# Altium schematic sheet Configuration&Clocking&SRAM.SchDoc: {Наименование}
size 420 x 297 mm; DocumentNumber: ВКА.821011.000.ПЗ; PageSetup: Record=PageOptions|CenterHorizontal=False|CenterVertical=False|PrintScale=0.70|XCorrection=0.00|YCorrection=0.00|PrintKind=1|BorderSize=5000000|LeftOffset=0|BottomOffset=0|Orientation=1|PaperLength=2970|PaperWidth=4200|Scale=100|PaperSource=7|PrintQuality=600|MediaType=1|DitherType=10|PrintScaleMode=1|PaperKind=A3 (повернуто)|PaperIndex=76; Rule: PcbType=ProtelPcb
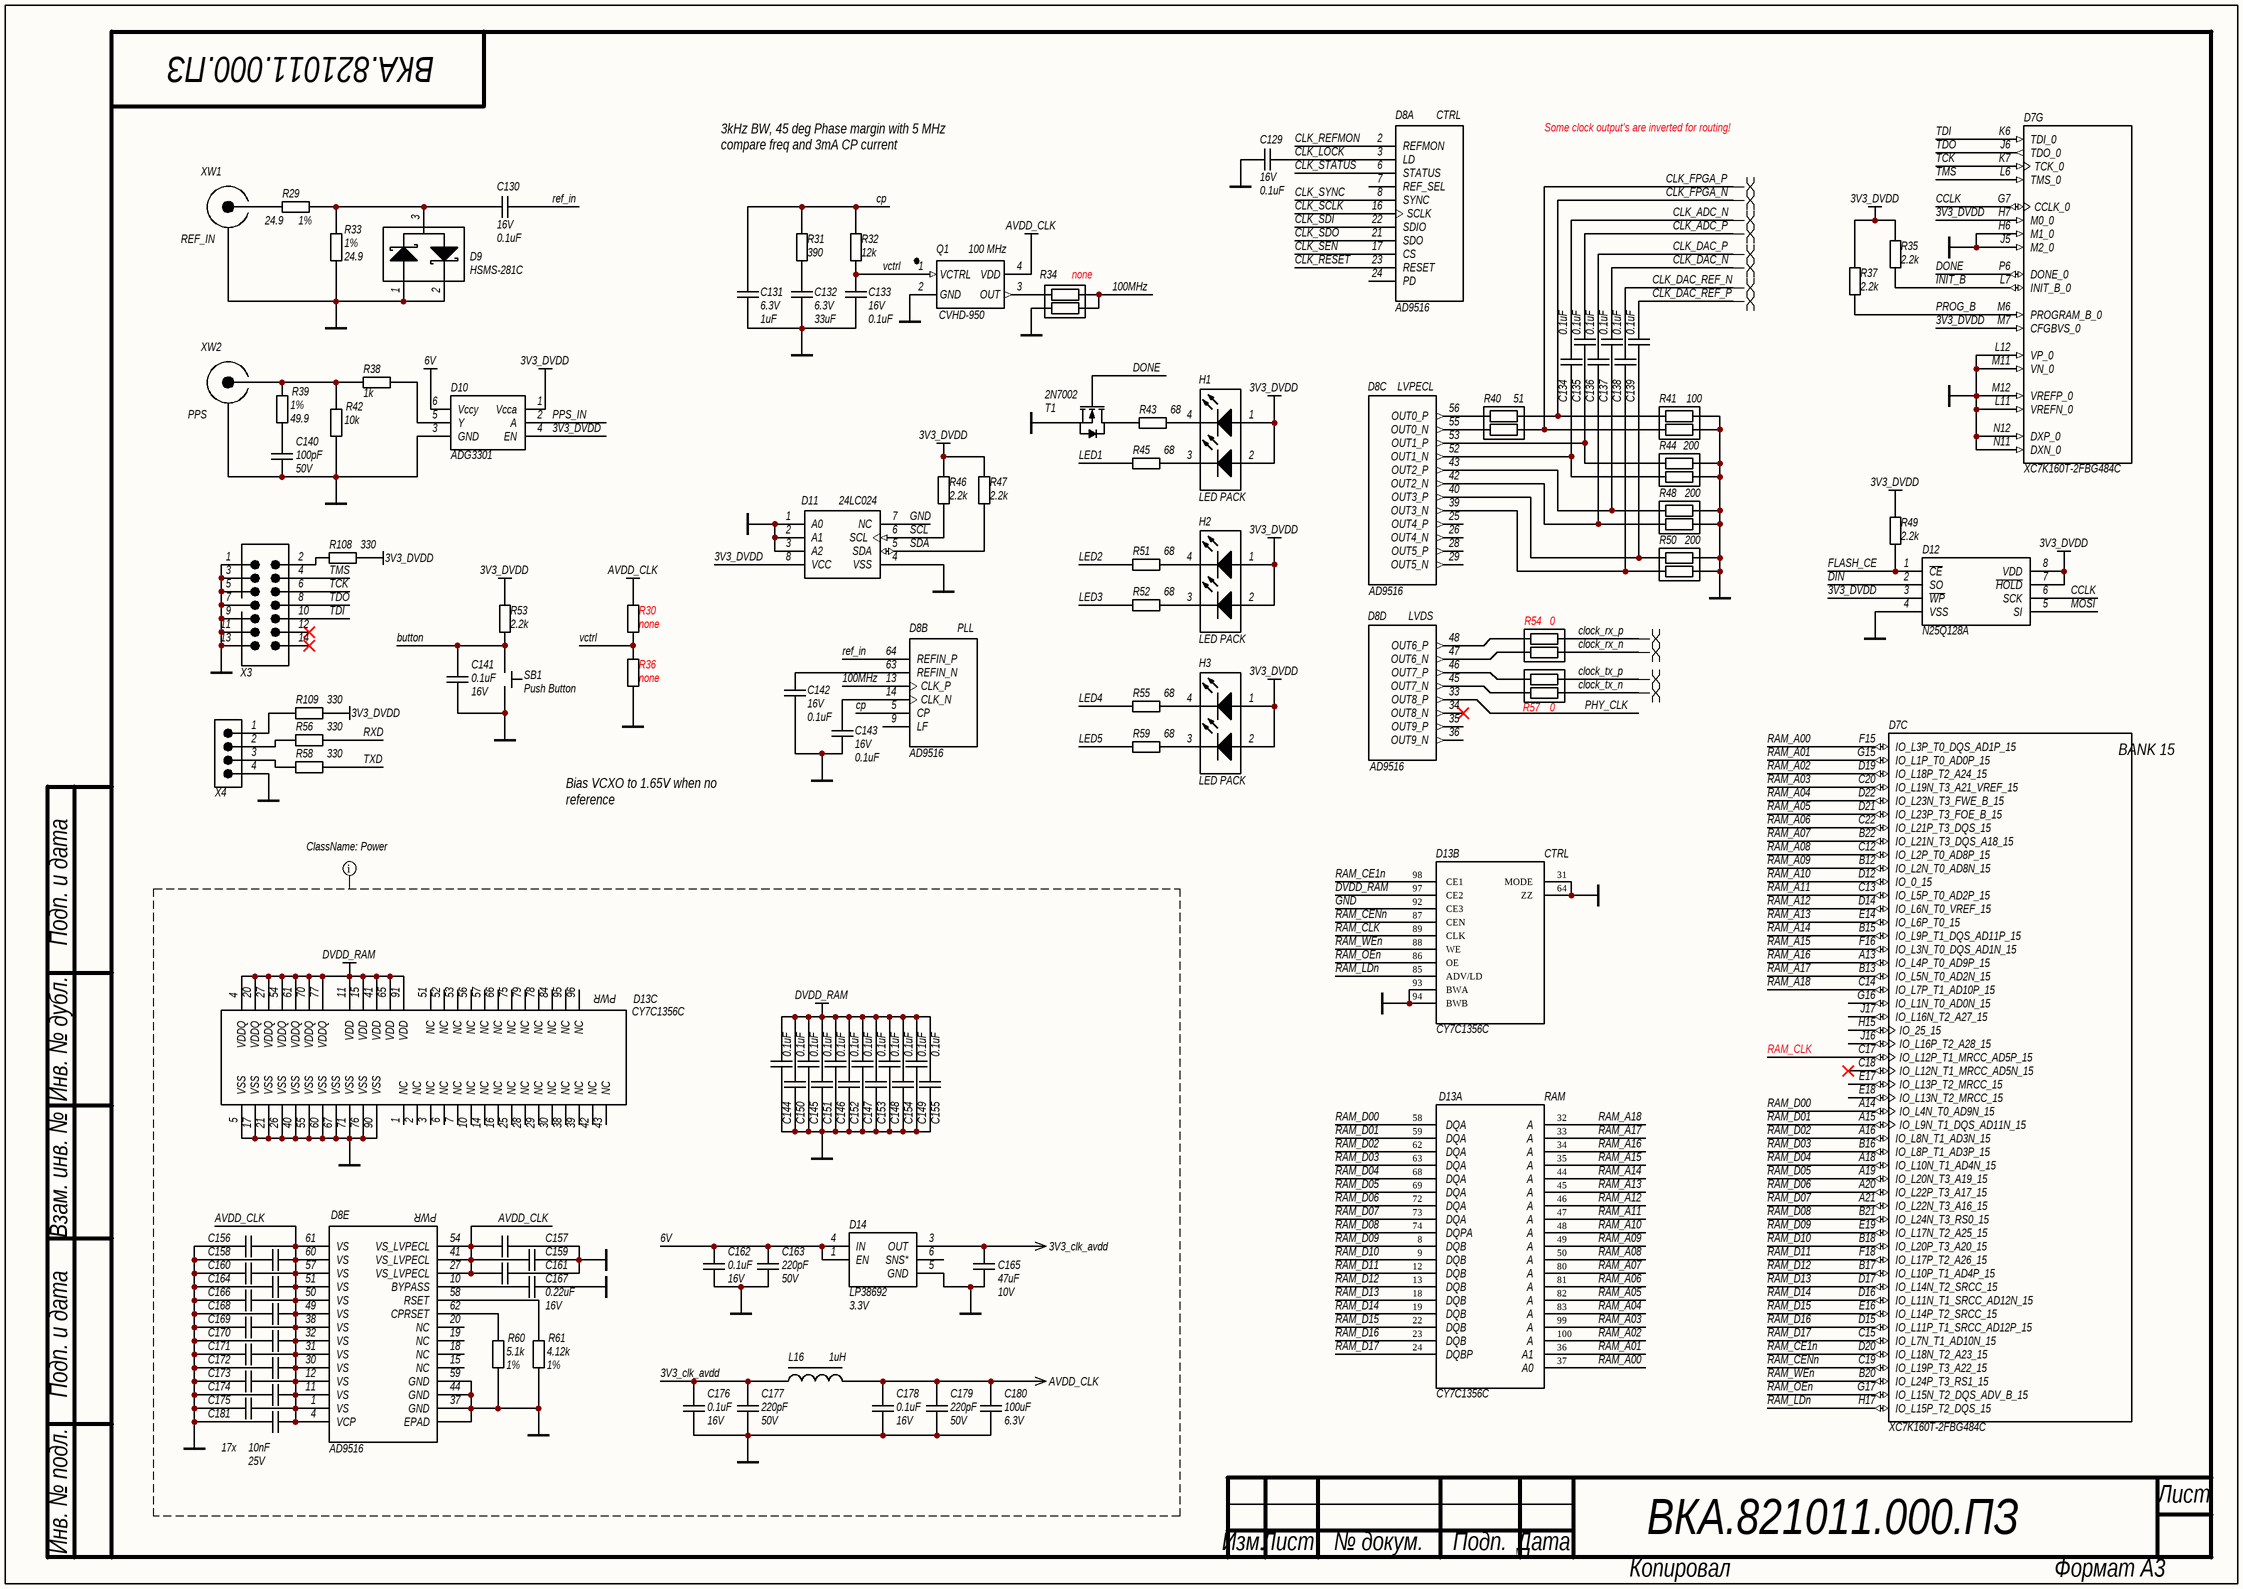
[diagram p0: Configuration&Clocking&SRAM.SchDoc]

## Parts
C129  value 0.1uF  Voltage: 16V  [C0402]  (hidden comment: CAP)
C130  value 0.1uF  Voltage: 16V  [C0402]  (hidden comment: CAP)
C131  value 1uF  Voltage: 6.3V  [C0402]  (hidden comment: CAP)
C132  value 33uF  Voltage: 6.3V  [C1210]  (hidden comment: CAP uF)
C133  value 0.1uF  Voltage: 16V  [C0402]  (hidden comment: CAP)
C134  value 0.1uF  [C0402]  (hidden comment: CAP)
C135  value 0.1uF  [C0402]  (hidden comment: CAP)
C136  value 0.1uF  [C0402]  (hidden comment: CAP)
C137  value 0.1uF  [C0402]  (hidden comment: CAP)
C138  value 0.1uF  [C0402]  (hidden comment: CAP)
C139  value 0.1uF  [C0402]  (hidden comment: CAP)
C140  value 100pF  Voltage: 50V  [C0603]  (hidden comment: CAP)
C141  value 0.1uF  Voltage: 16V  [C0402]  (hidden comment: CAP)
C142  value 0.1uF  Voltage: 16V  [C0402]  (hidden comment: CAP)
C143  value 0.1uF  Voltage: 16V  [C0402]  (hidden comment: CAP)
C144  value 0.1uF  [C0402]  (hidden comment: CAP)
C145  value 0.1uF  [C0402]  (hidden comment: CAP)
C146  value 0.1uF  [C0402]  (hidden comment: CAP)
C147  value 0.1uF  [C0402]  (hidden comment: CAP)
C148  value 0.1uF  [C0402]  (hidden comment: CAP)
C149  value 0.1uF  [C0402]  (hidden comment: CAP)
C150  value 0.1uF  [C0402]  (hidden comment: CAP)
C151  value 0.1uF  [C0402]  (hidden comment: CAP)
C152  value 0.1uF  [C0402]  (hidden comment: CAP)
C153  value 0.1uF  [C0402]  (hidden comment: CAP)
C154  value 0.1uF  [C0402]  (hidden comment: CAP)
C155  value 0.1uF  [C0402]  (hidden comment: CAP)
C156  CAP  [C0402]  (value not drawn)
C157  CAP  [C0402]  (value not drawn)
C158  CAP  [C0402]  (value not drawn)
C159  CAP  [C0402]  (value not drawn)
C160  CAP  [C0402]  (value not drawn)
C161  CAP  [C0402]  (value not drawn)
C162  value 0.1uF  Voltage: 16V  [C0603]  (hidden comment: CAP)
C163  value 220pF  Voltage: 50V  [C0603]  (hidden comment: CAP)
C164  CAP  [C0402]  (value not drawn)
C165  value 47uF  Voltage: 10V  [C1210]  (hidden comment: CAP uF)
C166  CAP  [C0402]  (value not drawn)
C167  value 0.22uF  Voltage: 16V  [C0402]  (hidden comment: CAP)
C168  CAP  [C0402]  (value not drawn)
C169  CAP  [C0402]  (value not drawn)
C170  CAP  [C0402]  (value not drawn)
C171  CAP  [C0402]  (value not drawn)
C172  CAP  [C0402]  (value not drawn)
C173  CAP  [C0402]  (value not drawn)
C174  CAP  [C0402]  (value not drawn)
C175  CAP  [C0402]  (value not drawn)
C176  value 0.1uF  Voltage: 16V  [C0603]  (hidden comment: CAP)
C177  value 220pF  Voltage: 50V  [C0603]  (hidden comment: CAP)
C178  value 0.1uF  Voltage: 16V  [C0603]  (hidden comment: CAP)
C179  value 220pF  Voltage: 50V  [C0603]  (hidden comment: CAP)
C180  value 100uF  Voltage: 6.3V  [C1210]  (hidden comment: CAP uF)
C181  value 10nF  Voltage: 25V  [C0402]  (hidden comment: CAP)
D7  XC7K160T-2FBG484C  [FBG484]  (parts C,G of 12)
D8  AD9516  [LFCSP-64]  (parts A,B,C,D,E of 5)
D9  HSMS-281C  [SOT-323]
D10  ADG3301  [SOT-23-6]
D11  24LC024  [SOIC_SN8]
D12  N25Q128A  [SOIC8-W]
D13  CY7C1356C  [TQFP-100]  (parts A,B,C of 3)
D14  LP38692  Voltage: 3.3V  [SOT-223-5]
H1  LED PACK  [LED_PACK]
H2  LED PACK  [LED_PACK]
H3  LED PACK  [LED_PACK]
L16  value 1uH  [L1210_Murata]  (hidden comment: Inductor LF)
Q1  CVHD-950  Frequency: 100 MHz  [CVHD-950]
R29  value 24.9  Tolerance: 1%  [R0402]  (hidden comment: RES)
R30  value none  [R0402]  (hidden comment: RES)
R31  value 390  [R0402]  (hidden comment: RES)
R32  value 12k  [R0402]  (hidden comment: RES)
R33  value 24.9  Tolerance: 1%  [R0402]  (hidden comment: RES)
R34  value none  [EX24V]  (hidden comment: RES 2x0402)
R35  value 2.2k  [R0402]  (hidden comment: RES)
R36  value none  [R0402]  (hidden comment: RES)
R37  value 2.2k  [R0402]  (hidden comment: RES)
R38  value 1k  [R0402]  (hidden comment: RES)
R39  value 49.9  Tolerance: 1%  [R0402]  (hidden comment: RES)
R40  value 51  [EX24V]  (hidden comment: RES 2x0402)
R41  value 100  [EX24V]  (hidden comment: RES 2x0402)
R42  value 10k  [R0402]  (hidden comment: RES)
R43  value 68  [R0402]  (hidden comment: RES)
R44  value 200  [EX24V]  (hidden comment: RES 2x0402)
R45  value 68  [R0402]  (hidden comment: RES)
R46  value 2.2k  [R0402]  (hidden comment: RES)
R47  value 2.2k  [R0402]  (hidden comment: RES)
R48  value 200  [EX24V]  (hidden comment: RES 2x0402)
R49  value 2.2k  [R0402]  (hidden comment: RES)
R50  value 200  [EX24V]  (hidden comment: RES 2x0402)
R51  value 68  [R0402]  (hidden comment: RES)
R52  value 68  [R0402]  (hidden comment: RES)
R53  value 2.2k  [R0402]  (hidden comment: RES)
R54  value 0  [EX24V]  (hidden comment: RES 2x0402)
R55  value 68  [R0402]  (hidden comment: RES)
R56  value 330  [R0402]  (hidden comment: RES)
R57  value 0  [EX24V]  (hidden comment: RES 2x0402)
R58  value 330  [R0402]  (hidden comment: RES)
R59  value 68  [R0402]  (hidden comment: RES)
R60  value 5.1k  Tolerance: 1%  [R0402]  (hidden comment: RES)
R61  value 4.12k  Tolerance: 1%  [R0402]  (hidden comment: RES)
R108  value 330  [R0402]  (hidden comment: RES)
R109  value 330  [R0402]  (hidden comment: RES)
SB1  Push Button  [B3FS-1000]
T1  2N7002  [SOT-23]
X3  HDR Debug_14-pin  [JTAG Header 14-pin]  (value not drawn)
X4  HDR 4-way  [Right Angle Male Header]  (value not drawn)
XW1  REF_IN  [SMA Angle Female]
XW2  PPS  [SMA Angle Female]

## Nets
3V3_clk_avdd: C165.2 C176.2 C177.2 D14.3(OUT) L16.1
3V3_DVDD: D7.H7(M0_0) D7.M7(CFGBVS_0) D10.1(Vcca) D10.4(EN) D11.8(VCC) D12.3(~{WP}) D12.7(~{HOLD}) D12.8(VDD) H1.1(A) H1.2(A) H2.1(A) H2.2(A) H3.1(A) H3.2(A) R35.2 R37.2 R46.2 R47.2 R49.2 R53.2 R108.1 R109.1
6V: C162.2 C163.2 D10.6(Vccy) D14.1(EN) D14.4(IN)
AVDD_CLK: C156.1 C157.2 C158.1 C159.2 C160.1 C161.2 C164.1 C166.1 C168.1 C169.1 C170.1 C171.1 C172.1 C173.1 C174.1 C175.1 C178.2 C179.2 C180.2 C181.1 D8.1(VS) D8.4(VCP) D8.11(VS) D8.12(VS) D8.27(VS_LVPECL) D8.30(VS) D8.31(VS) D8.32(VS) D8.38(VS) D8.41(VS_LVPECL) D8.49(VS) D8.50(VS) D8.51(VS) D8.54(VS_LVPECL) D8.57(VS) D8.60(VS) D8.61(VS) L16.2 Q1.4(VDD) R30.2
DVDD_RAM: C144.2 C145.2 C146.2 C147.2 C148.2 C149.2 C150.2 C151.2 C152.2 C153.2 C154.2 C155.2 D13.4(VDDQ) D13.11(VDD) D13.15(VDD) D13.20(VDDQ) D13.27(VDDQ) D13.41(VDD) D13.54(VDDQ) D13.61(VDDQ) D13.65(VDD) D13.70(VDDQ) D13.77(VDDQ) D13.91(VDD) D13.97(CE2)
GND: C129.2 C131.2 C132.2 C133.2 C140.1 C141.1 C142.2 C143.2 C144.1 C145.1 C146.1 C147.1 C148.1 C149.1 C150.1 C151.1 C152.1 C153.1 C154.1 C155.1 C156.2 C157.1 C158.2 C159.1 C160.2 C161.1 C162.1 C163.1 C164.2 C165.1 C166.2 C167.1 C168.2 C169.2 C170.2 C171.2 C172.2 C173.2 C174.2 C175.2 C176.1 C177.1 C178.1 C179.1 C180.1 C181.2 D7.H6(M1_0) D7.J5(M2_0) D7.L11(VREFN_0) D7.L12(VP_0) D7.M11(VN_0) D7.M12(VREFP_0) D7.N11(DXN_0) D7.N12(DXP_0) D8.0(EPAD) D8.37(GND) D8.44(GND) D8.59(GND) D9.1(A) D9.2(K) D10.3(GND) D11.1(A0) D11.2(A1) D11.3(A2) D11.4(VSS) D11.7(NC) D12.4(VSS) D13.5(VSS) D13.17(VSS) D13.21(VSS) D13.26(VSS) D13.31(MODE) D13.40(VSS) D13.55(VSS) D13.60(VSS) D13.64(ZZ) D13.67(VSS) D13.71(VSS) D13.76(VSS) D13.90(VSS) D13.92(CE3) D13.93(BWA) D13.94(BWB) D14.5(GND) Q1.2(GND) R33.1 R34.2 R36.1 R41.3 R41.4 R42.1 R44.3 R44.4 R48.3 R48.4 R50.3 R50.4 R60.1 R61.1 SB1.2 T1.2(S) X3.1(GND) X3.3(GND) X3.5(GND) X3.7(GND) X3.9(GND) X3.11(GND) X3.13(GND) X4.4(TMS) XW1.0(GND) XW2.0(GND)
100MHz: D8.13(CLK_P) R34.3 R34.4
button: C141.2 R53.1 SB1.1
CCLK: D7.G7(CCLK_0) D12.6(SCK)
CLK_ADC_N: C134.1
CLK_ADC_P: C135.1
CLK_DAC_N: C137.1
CLK_DAC_P: C136.1
CLK_DAC_REF_N: C138.1
CLK_DAC_REF_P: C139.1
CLK_FPGA_N: R40.4 R41.1
CLK_FPGA_P: R40.3 R41.2
CLK_LOCK: C129.1 D8.3(LD)
CLK_REFMON: D8.2(REFMON)
CLK_RESET: D8.23(RESET)
CLK_SCLK: D8.16(SCLK)
CLK_SDI: D8.22(SDIO)
CLK_SDO: D8.21(SDO)
CLK_SEN: D8.17(CS)
CLK_STATUS: D8.6(STATUS)
CLK_SYNC: D8.8(SYNC)
clock_rx_n: R54.3
clock_rx_p: R54.4
clock_tx_n: R57.3
clock_tx_p: R57.4
cp: C131.1 D8.5(CP) R31.1 R32.2
DIN: D12.2(SO)
DONE: D7.P6(DONE_0) T1.1(G)
FLASH_CE: D12.1(~{CE}) R49.1
INIT_B: D7.L7(INIT_B_0) R35.1
LED1: R45.2
LED2: R51.2
LED3: R52.2
LED4: R55.2
LED5: R59.2
MOSI: D12.5(SI)
PHY_CLK: D8.33(OUT8_P)
PPS_IN: D10.2(A)
PROG_B: D7.M6(PROGRAM_B_0) R37.1
RAM_A00: D7.F15(IO_L3P_T0_DQS_AD1P_15) D13.37(A0)
RAM_A01: D7.G15(IO_L1P_T0_AD0P_15) D13.36(A1)
RAM_A02: D7.D19(IO_L18P_T2_A24_15) D13.100(A)
RAM_A03: D7.C20(IO_L19N_T3_A21_VREF_15) D13.99(A)
RAM_A04: D7.D22(IO_L23N_T3_FWE_B_15) D13.83(A)
RAM_A05: D7.D21(IO_L23P_T3_FOE_B_15) D13.82(A)
RAM_A06: D7.C22(IO_L21P_T3_DQS_15) D13.81(A)
RAM_A07: D7.B22(IO_L21N_T3_DQS_A18_15) D13.80(A)
RAM_A08: D7.C12(IO_L2P_T0_AD8P_15) D13.50(A)
RAM_A09: D7.B12(IO_L2N_T0_AD8N_15) D13.49(A)
RAM_A10: D7.D12(IO_0_15) D13.48(A)
RAM_A11: D7.C13(IO_L5P_T0_AD2P_15) D13.47(A)
RAM_A12: D7.D14(IO_L6N_T0_VREF_15) D13.46(A)
RAM_A13: D7.E14(IO_L6P_T0_15) D13.45(A)
RAM_A14: D7.B15(IO_L9P_T1_DQS_AD11P_15) D13.44(A)
RAM_A15: D7.F16(IO_L3N_T0_DQS_AD1N_15) D13.35(A)
RAM_A16: D7.A13(IO_L4P_T0_AD9P_15) D13.34(A)
RAM_A17: D7.B13(IO_L5N_T0_AD2N_15) D13.33(A)
RAM_A18: D7.C14(IO_L7P_T1_AD10P_15) D13.32(A)
RAM_CE1n: D7.D20(IO_L18N_T2_A23_15) D13.98(CE1)
RAM_CENn: D7.C19(IO_L19P_T3_A22_15) D13.87(CEN)
RAM_CLK: D7.C17(IO_L12P_T1_MRCC_AD5P_15) D13.89(CLK)
RAM_D00: D7.A14(IO_L4N_T0_AD9N_15) D13.58(DQA)
RAM_D01: D7.A15(IO_L9N_T1_DQS_AD11N_15) D13.59(DQA)
RAM_D02: D7.A16(IO_L8N_T1_AD3N_15) D13.62(DQA)
RAM_D03: D7.B16(IO_L8P_T1_AD3P_15) D13.63(DQA)
RAM_D04: D7.A18(IO_L10N_T1_AD4N_15) D13.68(DQA)
RAM_D05: D7.A19(IO_L20N_T3_A19_15) D13.69(DQA)
RAM_D06: D7.A20(IO_L22P_T3_A17_15) D13.72(DQA)
RAM_D07: D7.A21(IO_L22N_T3_A16_15) D13.73(DQA)
RAM_D08: D7.B21(IO_L24N_T3_RS0_15) D13.74(DQPA)
RAM_D09: D7.E19(IO_L17N_T2_A25_15) D13.8(DQB)
RAM_D10: D7.B18(IO_L20P_T3_A20_15) D13.9(DQB)
RAM_D11: D7.F18(IO_L17P_T2_A26_15) D13.12(DQB)
RAM_D12: D7.B17(IO_L10P_T1_AD4P_15) D13.13(DQB)
RAM_D13: D7.D17(IO_L14N_T2_SRCC_15) D13.18(DQB)
RAM_D14: D7.D16(IO_L11N_T1_SRCC_AD12N_15) D13.19(DQB)
RAM_D15: D7.E16(IO_L14P_T2_SRCC_15) D13.22(DQB)
RAM_D16: D7.D15(IO_L11P_T1_SRCC_AD12P_15) D13.23(DQB)
RAM_D17: D7.C15(IO_L7N_T1_AD10N_15) D13.24(DQBP)
RAM_LDn: D7.H17(IO_L15P_T2_DQS_15) D13.85(ADV/LD)
RAM_OEn: D7.G17(IO_L15N_T2_DQS_ADV_B_15) D13.86(OE)
RAM_WEn: D7.B20(IO_L24P_T3_RS1_15) D13.88(WE)
ref_in: C130.1 D8.64(REFIN_P)
RXD: R56.1
SCL: D11.6(SCL) R46.1
SDA: D11.5(SDA) R47.1
TCK: D7.K7(TCK_0) X3.6(TCK)
TDI: D7.K6(TDI_0) X3.10(TDI)
TDO: D7.J6(TDO_0) X3.8(TDO)
TMS: D7.L6(TMS_0) X3.4(TMS)
TXD: R58.1
vctrl: C133.1 Q1.1(VCTRL) R30.1 R32.1 R36.2
NetC130_2: C130.2 D9.3(K) R29.2 R33.2
NetC132_1: C132.1 R31.2
NetC134_2: C134.2 D8.52(OUT1_N) R44.1
NetC135_2: C135.2 D8.53(OUT1_P) R44.2
NetC136_2: C136.2 D8.42(OUT2_N) R48.1
NetC137_2: C137.2 D8.43(OUT2_P) R48.2
NetC138_2: C138.2 D8.39(OUT3_N) R50.1
NetC139_2: C139.2 D8.40(OUT3_P) R50.2
NetC140_2: C140.2 R39.1
NetC142_1: C142.1 D8.63(REFIN_N)
NetC143_1: C143.1 D8.14(CLK_N)
NetC167_2: C167.2 D8.10(BYPASS)
NetD8_45: D8.45(OUT7_N) R57.2
NetD8_46: D8.46(OUT7_P) R57.1
NetD8_47: D8.47(OUT6_N) R54.2
NetD8_48: D8.48(OUT6_P) R54.1
NetD8_55: D8.55(OUT0_N) R40.2
NetD8_56: D8.56(OUT0_P) R40.1
NetD8_58: D8.58(RSET) R61.2
NetD8_62: D8.62(CPRSET) R60.2
NetD10_5: D10.5(Y) R38.1
NetH1_3: H1.3(K) R45.1
NetH1_4: H1.4(K) R43.1
NetH2_3: H2.3(K) R52.1
NetH2_4: H2.4(K) R51.1
NetH3_3: H3.3(K) R59.1
NetH3_4: H3.4(K) R55.1
NetQ1_3: Q1.3(OUT) R34.1
NetR29_1: R29.1 XW1.1(RF)
NetR38_2: R38.2 R39.2 R42.2 XW2.1(RF)
NetR43_2: R43.2 T1.3(D)
NetR56_2: R56.2 X4.2(VREF)
NetR58_2: R58.2 X4.3(GND)
NetR108_2: R108.2 X3.2(VREF)
NetR109_2: R109.2 X4.1(GND)

Not connected (* = marked no-connect by the designer): D7 C18(IO_L12N_T1_MRCC_AD5N_15)* E17(IO_L13P_T2_MRCC_15) E18(IO_L13N_T2_MRCC_15) G16(IO_L1N_T0_AD0N_15) H15(IO_25_15) J16(IO_L16P_T2_A28_15) J17(IO_L16N_T2_A27_15); D8 7(REF_SEL) 9(LF) 15(NC) 18(NC) 19(NC) 20(NC) 24(PD) 25(OUT4_P) 26(OUT4_N) 28(OUT5_P) 29(OUT5_N) 34(OUT8_N)* 35(OUT9_P) 36(OUT9_N); D13 1(NC) 2(NC) 3(NC) 6(NC) 7(NC) 10(NC) 14(NC) 16(NC) 25(NC) 28(NC) 29(NC) 30(NC) 38(NC) 39(NC) 42(NC) 43(NC) 51(NC) 52(NC) 53(NC) 56(NC) 57(NC) 66(NC) 75(NC) 78(NC) 79(NC) 84(NC) 95(NC) 96(NC); D14 6(SNS*); X3 12(NC)* 14(NC)*

## Layout directives
net class Power: 3V3_clk_avdd, 6V, AVDD_CLK, DVDD_RAM, GND
differential pair: CLK_ADC_N, CLK_ADC_P, CLK_DAC_N, CLK_DAC_P, CLK_DAC_REF_N, CLK_DAC_REF_P, CLK_FPGA_N, CLK_FPGA_P, clock_rx_n, clock_rx_p, clock_tx_n, clock_tx_p

## Notes on the sheet
- 3kHz BW, 45 deg Phase margin with 5 MHz compare freq and 3mA CP current
- Some clock output's are inverted for routing!
- Bias VCXO to 1.65V when no reference
- 17x
- Подп. и дата
- Инв. № дубл.
- Взам. инв. №
- Инв. № подл.
- Лист
- Изм.
- № докум.
- Подп.
- Дата
- Копировал
- Формат А3
- (in symbol AD9516, part A) CTRL
- (in symbol AD9516, part B) PLL
- (in symbol AD9516, part C) LVPECL
- (in symbol AD9516, part D) LVDS
- (in symbol AD9516, part E) PWR
- (in symbol CY7C1356C, part A) RAM
- (in symbol CY7C1356C, part B) CTRL
- (in symbol CY7C1356C, part C) PWR
- (in symbol XC7K160T-2FBG484C, part C) BANK 15

## Library data of the parts
C129 C130 C133 C141-C143 = CAP: SMD Capacitor; Manufacturer: Murata; Material: X7R; Tolerance: 10%; Type: Ceramic Capacitor; P/N: GRM155R71C104KA88J
C131 = CAP: SMD Capacitor; Manufacturer: Murata; Material: X7R; Tolerance: 10%; Type: Ceramic Capacitor; P/N: GRM155R70J105KA12D
C132 = CAP uF: SMD Capacitor; Manufacturer: Murata; Material: X7R; Tolerance: 10%; Type: Ceramic Capacitor; P/N: GRM32DR60J336ME19L
C134-C139 C144-C155 = CAP: SMD Capacitor; Manufacturer: Murata; Material: X7R; Tolerance: 10%; Voltage: 16V; Type: Ceramic Capacitor; P/N: GRM155R71C104KA88J
C140 = CAP: SMD Capacitor; Manufacturer: Murata; Material: NP0; Tolerance: 10%; Type: Ceramic Capacitor; P/N: GRM1555C1H101JA01D
C156-C161 C164 C166 C168-C175 = CAP: SMD Capacitor; Manufacturer: Murata; Material: X7R; Tolerance: 10%; Voltage: 25V; Type: Ceramic Capacitor; Value: 10nF; P/N: GRM155R71E103KA01D
C162 C176 C178 = CAP: SMD Capacitor; Manufacturer: Murata; Material: X7R; Tolerance: 10%; Type: Ceramic Capacitor; P/N: GRM188R71C104KA01D
C163 C177 C179 = CAP: SMD Capacitor; Manufacturer: Murata; Material: X7R; Tolerance: 10%; Type: Ceramic Capacitor; P/N: GRM188R71H221KA01D
C165 = CAP uF: SMD Capacitor; Manufacturer: Murata; Material: X7R; Tolerance: 10%; Type: Ceramic Capacitor; P/N: GRM32ER71A476KE15L
C167 = CAP: SMD Capacitor; Manufacturer: Murata; Material: X7R; Tolerance: 10%; Type: Ceramic Capacitor; P/N: GRM155R71C224KA12D
C180 = CAP uF: SMD Capacitor; Manufacturer: Murata; Material: X5R; Tolerance: 20%; Type: Ceramic Capacitor; P/N: GRM32ER60J107ME20L
C181 = CAP: SMD Capacitor; Manufacturer: Murata; Material: X7R; Tolerance: 10%; Type: Ceramic Capacitor; P/N: GRM155R71E103KA01D
D7 = XC7K160T-2FBG484C: Xilinx 7-Series FPGA; Speed Grade: -2; Manufacturer: Xilinx; Name: XC7K160T-2FBG484C; Series: 7-Series FPGA; Package: 484 Ball FBG
D8 = AD9516: 14-Output Clock Generator; Input Frequency: 0 to 2.4 GHz; Input Sensitivity: 150 mV p-p; Name: AD9516-4; Output Frequency, Maximum: 2950 MHz; Voltage: 2.5 V to 3.3 V; Package: LFSCSP-64; Temperature Range: −40°C to +85°C; Type: 14-Output Clock Generator
D9 = HSMS-281x: RF Schottky Barrier Diodes; Name: HSMS-281C; Package: SOT-323
D10 = ADG3301: Bidirectional Logic Level Translator; Voltage: 1.15 V to 5.5 V; Name: ADG3301; Package: SOT-23-6
D11 = 24LC024: I2C EEPROM; Manufacturer: Microchip; Capacity: 2kbit; Max Clock: 400 kHz; Voltage: 2.5-5.5V; Name: 24LC024; Package: SOIC-8; Type: I2C EEPROM
D12 = N25Q128A: SPI Flash; Manufacturer: Micron Technology; Device Density: 128 Mbit; Name: N25Q128A13ESE40; Operating Frequency: 50 MHz; Voltage: 2.7-3.6V; Package: SOIC; Temperature Range: 0°C to +70°C; Type: SPI Flash
D13 = CY7C1356C: Pipelined SRAM with NoBL; Name: CY7C1356C-250AXC; Type: 9-Mbit (512 K × 18); Voltage: 3.3 V; Package: 100-pin TQFP (14 × 20 × 1.4 mm)
D14 = LP38692: Linear Regulator; P/N: LP38692MP-3.3/NOPB
H1-H3 = LED_PACK: LED Pack For Front Panel; Manufacturer: Kingbright; Current: 25mA; P/N: WP934EB/2GD; Color: Green; Package: Throu-Hole; Type: 2-level PCB-mount LED-indicator
L16 = Inductor LF: Inductor Power Lines; Manufacturer: Murata; Name: LQM32PN1R0MG0; Current: 2500mA; Tolerance: 5%; Frequency: 100MHz; Temperature Range: -25ºC to 85ºC; Series: LQM; P/N: LQM32PN1R0MG0
Q1 = CVHD-950: Crystal Oscillator; Input Current: 15mA Typical; Name: CVHD-950-100.000; Output: Unsymmetry; Output Current: ±24mA Max; Voltage: 3.3V ±0.3V; Package: CVHD-950; Temperature Range: 0°C to +70°C
R29 R33 = RES: SMD Resistor; Name: Chip SMD Resistor; Power: 0.062 Wt; P/N: ERJ-2RKF24R9X; Temperature Range: -55…155°C
R30 R36 = RES: SMD Resistor; Name: Chip SMD Resistor; Power: 0.062 Wt; Temperature Range: -55…155°C
R31 = RES: SMD Resistor; Name: Chip SMD Resistor; Power: 0.062 Wt; Tolerance: 5%; P/N: ERJ-2GEJ391X; Temperature Range: -55…155°C
R32 = RES: SMD Resistor; Name: Chip SMD Resistor; Power: 0.062 Wt; Tolerance: 5%; P/N: ERJ-2GEJ123X; Temperature Range: -55…155°C
R34 = RES 2x0402: Chip Resistor Array; Manufacturer: Panasonic; Name: EXB24V; Number of Resistors: 2; Tolerance: 5%; P/N: EXB-24V270JX; Type: 0402 Array Convex Terminal; Number of Terminals: 4; Series: EXB
R35 R37 R46 R47 R49 R53 = RES: SMD Resistor; Name: Chip SMD Resistor; Power: 0.062 Wt; Tolerance: 5%; P/N: ERJ-2GEJ222X; Temperature Range: -55…155°C
R38 = RES: SMD Resistor; Name: Chip SMD Resistor; Power: 0.062 Wt; Tolerance: 5%; P/N: ERJ-2GEJ102X; Temperature Range: -55…155°C
R39 = RES: SMD Resistor; Name: Chip SMD Resistor; Power: 0.062 Wt; P/N: ERJ-2RKF49R9X; Temperature Range: -55…155°C
R40 = RES 2x0402: Chip Resistor Array; Manufacturer: Panasonic; Name: EXB24V; Number of Resistors: 2; Tolerance: 5%; P/N: EXB-24V510JX; Type: 0402 Array Convex Terminal; Number of Terminals: 4; Series: EXB
R41 = RES 2x0402: Chip Resistor Array; Manufacturer: Panasonic; Name: EXB24V; Number of Resistors: 2; Tolerance: 5%; P/N: EXB-24V101JX; Type: 0402 Array Convex Terminal; Number of Terminals: 4; Series: EXB
R42 = RES: SMD Resistor; Name: Chip SMD Resistor; Power: 0.062 Wt; Tolerance: 5%; P/N: ERJ-2GEJ103X; Temperature Range: -55…155°C
R43 R45 R51 R52 R55 R59 = RES: SMD Resistor; Name: Chip SMD Resistor; Power: 0.062 Wt; Tolerance: 5%; P/N: ERJ-2GEJ680X; Temperature Range: -55…155°C
R44 R48 R50 = RES 2x0402: Chip Resistor Array; Manufacturer: Panasonic; Name: EXB24V; Number of Resistors: 2; Tolerance: 5%; P/N: EXB-24V201JX; Type: 0402 Array Convex Terminal; Number of Terminals: 4; Series: EXB
R54 R57 = RES 2x0402: Chip Resistor Array; Manufacturer: Panasonic; Name: EXB24V; Number of Resistors: 2; P/N: EXB-24VR000X; Type: 0402 Array Convex Terminal; Number of Terminals: 4; Series: EXB
R56 R58 R108 R109 = RES: SMD Resistor; Name: Chip SMD Resistor; Power: 0.062 Wt; Tolerance: 5%; P/N: ERJ-2GEJ331X; Temperature Range: -55…155°C
R60 = RES: SMD Resistor; Name: Chip SMD Resistor; Power: 0.062 Wt; P/N: ERJ-2RKF5101X; Temperature Range: -55…155°C
R61 = RES: SMD Resistor; Name: Chip SMD Resistor; Power: 0.062 Wt; P/N: ERJ-2RKF4121X; Temperature Range: -55…155°C
SB1 = Button: Tactile Switch (SMT); Manufacturer: Omron; Current: 50mA; Operating  force: 2.55 N; Plunger  color: Black; Voltage: 24V; Name: B3FS-1000; Package: 6x6 SMT; Series: B3FS-1000; Type: Tactile Switch (SMT)
T1 = 2N7002: N-Channel MOSFET 2N7002; Channel Resistance: 5Ohm; Current: 300mA; Power Dissipation: 0.83W; Voltage: 60V; Name: 2N7002; Type: SOT-23; Package: SOT-23
X3 = HDR Debug_14-pin: 14-pin 2.54mm pitch PCB Header; Name: JTAG Header 7x2; Type: Two Row Male Header 100mil Step
X4 = HDR 4-way: 4-way Angle PCB Header; Pitch: 2.54mm; Name: Header; Package: Through Hole; Type: Right Angle
XW1 XW2 = SMA RF Connector: SMA Male Right-Angle PCM Connector; Manufacturer: Molex; Name: SMA Right Angle PCB Mount RF Connector; P/N: 732512201; Impedance: 50Ohm; Type: SMA Jack, Right Angle; Series: 73251